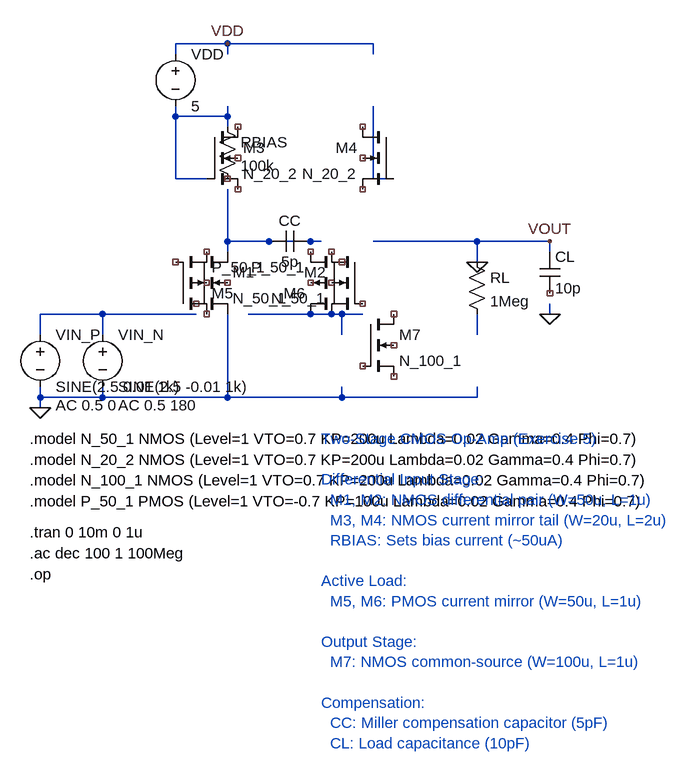
[diagram p0: schematic Exercise5_TwoStage_OpAmp.asc]
Exercise5_TwoStage_OpAmp.asc, the LTspice schematic file:
Version 4
SHEET 1 1600 1000
WIRE 384 -352 304 -352
WIRE 608 -352 384 -352
WIRE 304 -336 304 -352
WIRE 384 -336 384 -352
WIRE 608 -336 608 -352
WIRE 304 -240 304 -256
WIRE 384 -240 384 -256
WIRE 384 -240 304 -240
WIRE 608 -240 608 -256
WIRE 384 -224 384 -240
WIRE 304 -144 304 -240
WIRE 352 -144 304 -144
WIRE 608 -144 608 -240
WIRE 640 -144 608 -144
WIRE 384 -48 384 -128
WIRE 528 -48 384 -48
WIRE 768 -48 608 -48
WIRE 880 -48 768 -48
WIRE 384 -32 384 -48
WIRE 880 -32 880 -48
WIRE 768 -16 768 -48
WIRE 192 64 96 64
WIRE 304 64 192 64
WIRE 336 64 304 64
WIRE 560 64 416 64
WIRE 592 64 560 64
WIRE 880 64 880 48
WIRE 96 96 96 64
WIRE 192 96 192 64
WIRE 560 96 560 64
WIRE 768 96 768 64
WIRE 96 192 96 176
WIRE 192 192 192 176
WIRE 192 192 96 192
WIRE 384 192 384 64
WIRE 384 192 192 192
WIRE 560 192 560 176
WIRE 560 192 384 192
WIRE 768 192 768 176
WIRE 768 192 560 192
WIRE 96 208 96 192
FLAG 96 208 0
FLAG 384 -352 VDD
FLAG 880 -48 VOUT
FLAG 880 64 0
FLAG 768 -16 0
SYMBOL nmos4 336 -32 R0
SYMATTR InstName M1
SYMATTR Value N_50_1
SYMBOL nmos4 592 -32 M0
SYMATTR InstName M2
SYMATTR Value N_50_1
SYMBOL nmos4 352 -224 R0
SYMATTR InstName M3
SYMATTR Value N_20_2
SYMBOL nmos4 640 -224 M0
SYMATTR InstName M4
SYMATTR Value N_20_2
SYMBOL pmos4 304 64 M180
SYMATTR InstName M5
SYMATTR Value P_50_1
SYMBOL pmos4 560 64 R180
SYMATTR InstName M6
SYMATTR Value P_50_1
SYMBOL nmos4 592 64 R0
SYMATTR InstName M7
SYMATTR Value N_100_1
SYMBOL voltage 96 80 R0
WINDOW 123 24 124 Left 2
WINDOW 39 0 0 Left 0
SYMATTR Value2 AC 0.5 0
SYMATTR InstName VIN_P
SYMATTR Value SINE(2.5 0.01 1k)
SYMBOL voltage 192 80 R0
WINDOW 123 24 124 Left 2
WINDOW 39 0 0 Left 0
SYMATTR Value2 AC 0.5 180
SYMATTR InstName VIN_N
SYMATTR Value SINE(2.5 -0.01 1k)
SYMBOL voltage 304 -352 R0
SYMATTR InstName VDD
SYMATTR Value 5
SYMBOL res 368 -240 R0
SYMATTR InstName RBIAS
SYMATTR Value 100k
SYMBOL cap 512 -64 R90
WINDOW 0 0 32 VBottom 2
WINDOW 3 32 32 VTop 2
SYMATTR InstName CC
SYMATTR Value 5p
SYMBOL cap 864 -32 R0
SYMATTR InstName CL
SYMATTR Value 10p
SYMBOL res 752 -32 R0
SYMATTR InstName RL
SYMATTR Value 1Meg
TEXT 80 256 Left 2 !.model N_50_1 NMOS (Level=1 VTO=0.7 KP=200u Lambda=0.02 Gamma=0.4 Phi=0.7)
TEXT 80 288 Left 2 !.model N_20_2 NMOS (Level=1 VTO=0.7 KP=200u Lambda=0.02 Gamma=0.4 Phi=0.7)
TEXT 80 320 Left 2 !.model N_100_1 NMOS (Level=1 VTO=0.7 KP=200u Lambda=0.02 Gamma=0.4 Phi=0.7)
TEXT 80 352 Left 2 !.model P_50_1 PMOS (Level=1 VTO=-0.7 KP=100u Lambda=0.02 Gamma=0.4 Phi=0.7)
TEXT 80 400 Left 2 !.tran 0 10m 0 1u
TEXT 80 432 Left 2 !.ac dec 100 1 100Meg
TEXT 80 464 Left 2 !.op
TEXT 528 256 Left 2 ;Two-Stage CMOS Op-Amp (Exercise 5)\n \nDifferential Input Stage:\n  M1, M2: NMOS differential pair (W=50u, L=1u)\n  M3, M4: NMOS current mirror tail (W=20u, L=2u)\n  RBIAS: Sets bias current (~50uA)\n \nActive Load:\n  M5, M6: PMOS current mirror (W=50u, L=1u)\n \nOutput Stage:\n  M7: NMOS common-source (W=100u, L=1u)\n \nCompensation:\n  CC: Miller compensation capacitor (5pF)\n  CL: Load capacitance (10pF)

The netlist it stands for:
* Exercise5_TwoStage_OpAmp.asc
* M1: N_50_1 (symbol nmos4 not certain, pin order unknown); nets seen at it: 0, N003
* M2: N_50_1 (symbol nmos4 not certain, pin order unknown); nets seen at it: N005
* M3: N_20_2 (symbol nmos4 not certain, pin order unknown); nets seen at it: N001
M4 NC_09 N002 NC_10 NC_11 N_20_2
* M5: P_50_1 (symbol pmos4 not certain, pin order unknown); nets seen at it: 
M6 N005 NC_16 NC_17 NC_18 P_50_1
* M7: N_100_1 (symbol nmos4 not certain, pin order unknown); nets seen at it: 
VIN_P N004 0 SINE(2.5 0.01 1k) AC 0.5 0
VIN_N N004 0 SINE(2.5 -0.01 1k) AC 0.5 180
VDD VDD N001 5
RBIAS N001 NC_23 100k
CC N003 N003 5p
CL 0 NC_24 10p
RL 0 N006 1Meg
.model NMOS NMOS
.model PMOS PMOS
.lib standard.mos
.model N_50_1 NMOS (Level=1 VTO=0.7 KP=200u Lambda=0.02 Gamma=0.4 Phi=0.7)
.model N_20_2 NMOS (Level=1 VTO=0.7 KP=200u Lambda=0.02 Gamma=0.4 Phi=0.7)
.model N_100_1 NMOS (Level=1 VTO=0.7 KP=200u Lambda=0.02 Gamma=0.4 Phi=0.7)
.model P_50_1 PMOS (Level=1 VTO=-0.7 KP=100u Lambda=0.02 Gamma=0.4 Phi=0.7)
.tran 0 10m 0 1u
.ac dec 100 1 100Meg
.op
* Two-Stage CMOS Op-Amp (Exercise 5)
* Differential Input Stage:
*   M1, M2: NMOS differential pair (W=50u, L=1u)
*   M3, M4: NMOS current mirror tail (W=20u, L=2u)
*   RBIAS: Sets bias current (~50uA)
* Active Load:
*   M5, M6: PMOS current mirror (W=50u, L=1u)
* Output Stage:
*   M7: NMOS common-source (W=100u, L=1u)
* Compensation:
*   CC: Miller compensation capacitor (5pF)
*   CL: Load capacitance (10pF)
.backanno
.end